# EAGLE design relais_karte (EAGLE 6.6.0)
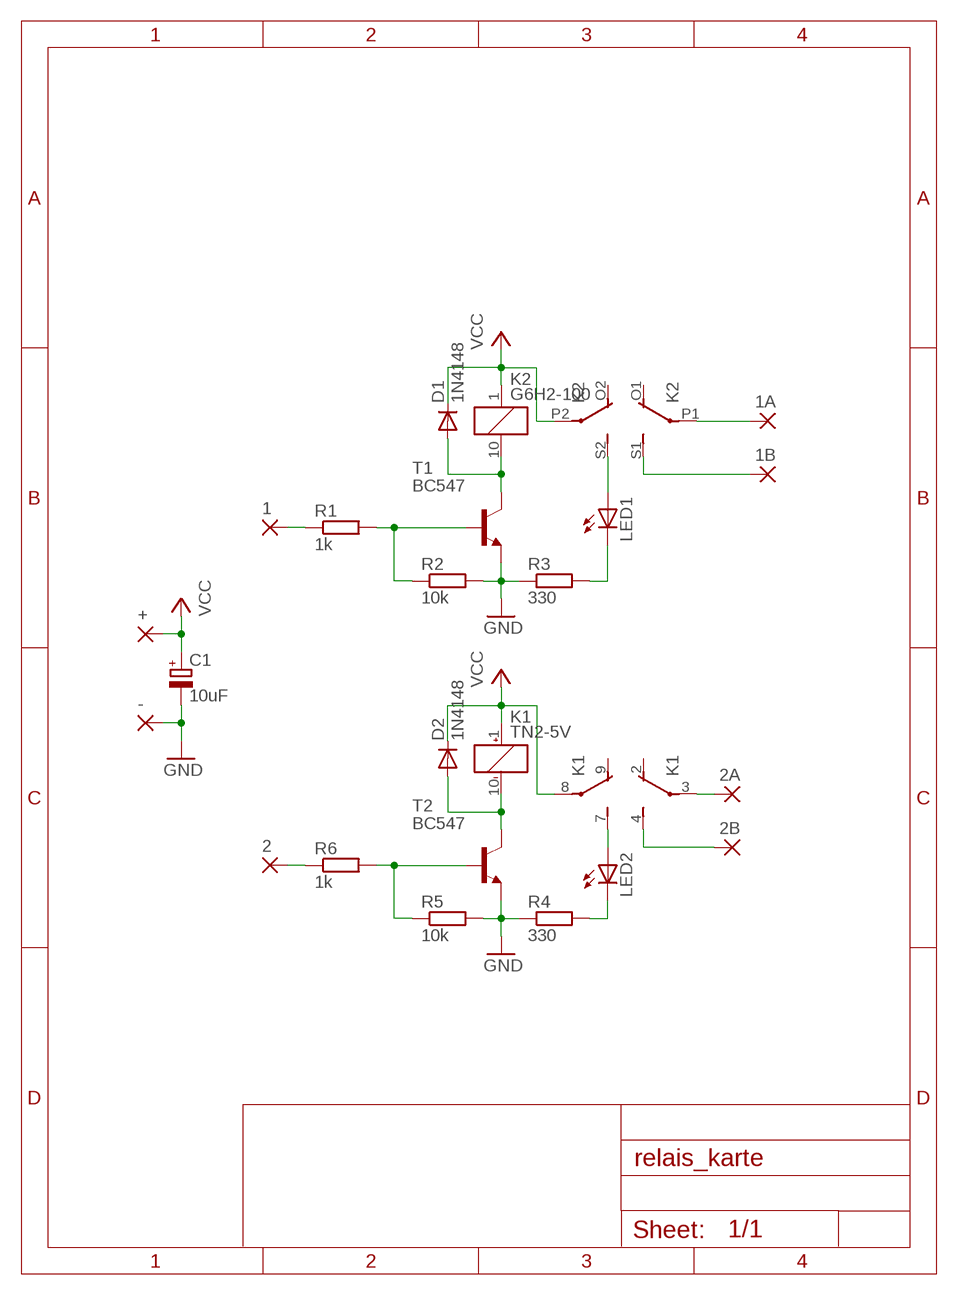
[diagram p0: schematic, sheet 1]

## Parts
1  WIREPAD2,15/1,0  [2,15/1,0]
1A  WIREPAD2,15/1,0  [2,15/1,0]
1B  WIREPAD2,15/1,0  [2,15/1,0]
2  WIREPAD2,15/1,0  [2,15/1,0]
2A  WIREPAD2,15/1,0  [2,15/1,0]
2B  WIREPAD2,15/1,0  [2,15/1,0]
+  WIREPAD2,15/1,0  [2,15/1,0]
-  WIREPAD2,15/1,0  [2,15/1,0]
C1  10uF  CPOL-EUB45181A  [B45181A]
D1  1N4148  1N4148DO35-7  [DO35-7]
D2  1N4148  1N4148DO35-7  [DO35-7]
K1  TN2-5V  [TN2]
K2  G6H2-100  [G6H2-100]
LED1  LED5MM  [LED5MM]
LED2  LED5MM  [LED5MM]
R1  1k  R-EU_0204/7  [0204/7]
R2  10k  R-EU_0204/7  [0204/7]
R3  330  R-EU_0204/7  [0204/7]
R4  330  R-EU_0204/7  [0204/7]
R5  10k  R-EU_0204/7  [0204/7]
R6  1k  R-EU_0204/7  [0204/7]
T1  BC547  -NPN-TO92-EBC  [TO92-EBC]
T2  BC547  -NPN-TO92-EBC  [TO92-EBC]

## Nets
GND: -.1(P) C1.- R2.2 R3.1 R4.1 R5.2 T1.E T2.E
N$1: D1.A K2.10 T1.C
N$2: LED1.K(C) R3.2
N$3: K2.S2(3:S) LED1.A
N$4: 1B.1(P) K2.S1(2:S)
N$5: R1.2 R2.1 T1.B
N$6: 1A.1(P) K2.P1(2:P)
N$7: 1.1(P) R1.1
N$8: D2.A K1.10(-:-) T2.C
N$9: LED2.K(C) R4.2
N$10: K1.7(2:S) LED2.A
N$11: R5.1 R6.2 T2.B
N$12: 2.1(P) R6.1
N$13: 2B.1(P) K1.4(1:S)
N$14: 2A.1(P) K1.3(1:P)
VCC: +.1(P) C1.+ D1.C D2.C K1.1(-:+) K1.8(2:P) K2.1 K2.P2(3:P)
Unconnected: K1.2(1:O) K1.9(2:O) K2.O1(2:O) K2.O2(3:O)

## Library data of the parts
1 1A 1B 2 2A 2B + - = wirepad:WIREPAD: Wire PAD connect wire on PCB
C1 = rcl:CPOL-EU: POLARIZED CAPACITOR, European symbol
D1 D2 = diode:1N4148: DIODE high speed (Philips)
K1 = relay:TN2?-*: SLIM POLARIZED RELAY NAiS Source: http://www.mew-europe.com/.. en_ds_61019_0000.pdf; MF: AROMAT/ MATSUSHITA; MPN: TN2-5V; OC_FARNELL: 1200955; OC_NEWARK: 64K3189
K2 = relay:G6H2-100: RELAY 2 x switch, 0.5 A/125 V AC, 1 A/30 V DC, Omron; OC_FARNELL: unknown; OC_NEWARK: unknown
LED1 LED2 = led:LED: LED OSRAM: - CHIPLED LG R971, LG N971, LY N971, LG Q971, LY Q971, LO R971, LY R971 LH N974, LH R974 LS Q976, LO Q976, LY Q976 LO Q996 - Hyper CHIPLED LW Q18S LB Q993, LB Q99A, LB R99A - SideLED LS A670, LO A670, LY A670, LG A670, LP A670 LB A673, LV A673, LT A673, LW A673 LH A674 LY A675 LS A676, LA A676, LO A676, LY A676, LW A676 LS A679, LY A679, LG A679 - Hyper Micro SIDELED® LS Y876, LA Y876, LO Y876, LY Y876 LT Y87S - SmartLED LW L88C, LW L88S LB L89C, LB L89S, LG L890 LS L89K, LO L89K, LY L89K LS L896, LA L896, LO L896, LY L896 - TOPLED LS T670, LO T670, LY T670, LG T670, LP T670 LSG T670, LSP T670, LSY T670, LOP T670, LYG T670 LG T671, LOG T671, LSG T671 LB T673, LV T673, LT T673, LW T673 LH T674 LS T676, LA T676, LO T676, LY T676, LB T676, LH T676, LSB T676, LW T676 LB T67C, LV T67C, LT T67C, LS T67K, LO T67K, LY T67K, LW E67C LS E67B, LA E67B, LO E67B, LY E67B, LB E67C, LV E67C, LT E67C LW T67C LS T679, LY T679, LG T679 LS T770, LO T770, LY T770, LG T770, LP T770 LB T773, LV T773, LT T773, LW T773 LH T774 LS E675, LA E675, LY E675, LS T675 LS T776, LA T776, LO T776, LY T776, LB T776 LHGB T686 LT T68C, LB T68C - Hyper Mini TOPLED® LB M676 - Mini TOPLED Santana® LG M470 LS M47K, LO M47K, LY M47K Source: http://www.osram.convergy.de LUXEON: - LUMILED® LXK2-PW12-R00, LXK2-PW12-S00, LXK2-PW14-U00, LXK2-PW14-V00 LXK2-PM12-R00, LXK2-PM12-S00, LXK2-PM14-U00 LXK2-PE12-Q00, LXK2-PE12-R00, LXK2-PE12-S00, LXK2-PE14-T00, LXK2-PE14-U00 LXK2-PB12-K00, LXK2-PB12-L00, LXK2-PB12-M00, LXK2-PB14-N00, LXK2-PB14-P00, LXK2-PB14-Q00 LXK2-PR12-L00, LXK2-PR12-M00, LXK2-PR14-Q00, LXK2-PR14-R00 LXK2-PD12-Q00, LXK2-PD12-R00, LXK2-PD12-S00 LXK2-PH12-R00, LXK2-PH12-S00 LXK2-PL12-P00, LXK2-PL12-Q00, LXK2-PL12-R00 Source: www.luxeon.com KINGBRIGHT: KA-3528ASYC Source: www.kingbright.com
R1-R6 = rcl:R-EU_: RESISTOR, European symbol
T1 T2 = transistor:*-NPN-: NPN Transistror BF959 corrected 2008.03.06

## Board
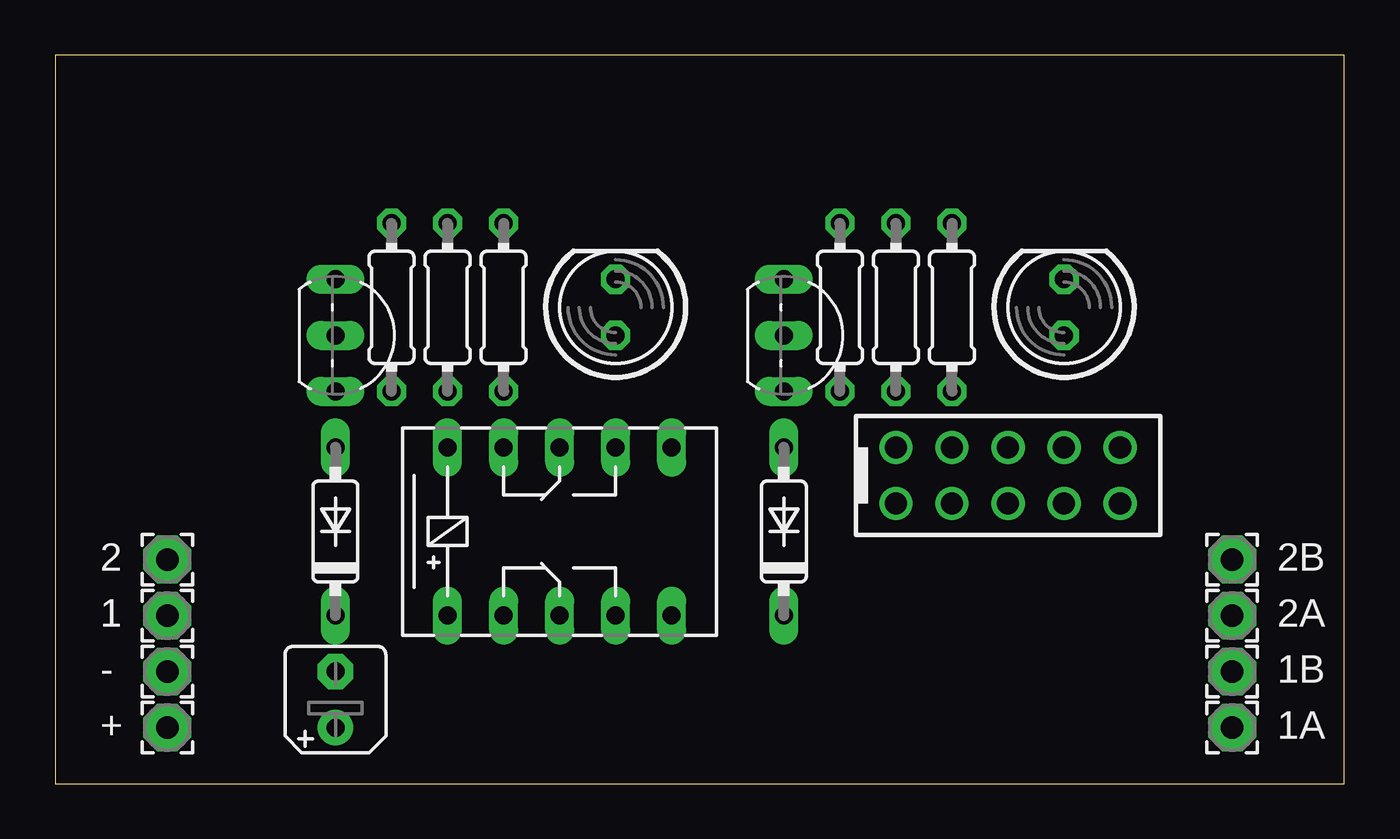
[diagram p1: board, top side]
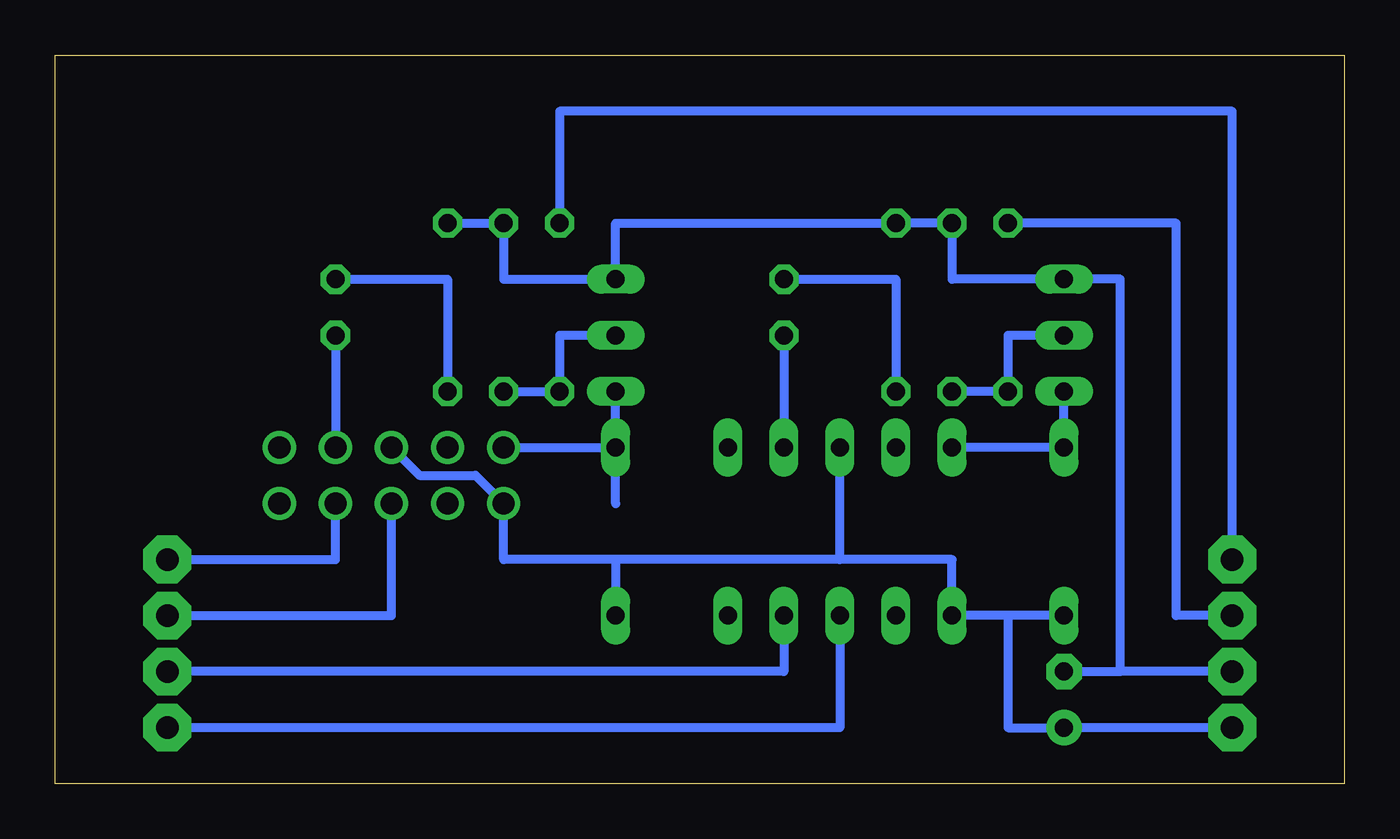
[diagram p2: board, bottom side, seen from below]

Size 58.42 x 33.02 mm. Coordinates in mm from the lower left corner, seen from the top.
Outline: 0,0 58.42,0 58.42,33.02 0,33.02 0,0
Copper layers (1*16): Top 0.035mm / dielectric 1.5mm / Bottom 0.035mm
Design rules "default": minimum track width 10mil, minimum drill 24mil, track to track 8mil, track to pad 8mil, pad to pad 8mil, via to via 8mil, smd to smd 8mil, copper to edge 40mil, drill to drill 8mil, minimum pad ring 10mil, minimum via ring 8mil, stop-mask expansion 4mil, vias tented up to drill 0mil, thermal gap 10mil

### Footprints (pad centres in the part's own frame; a part is rotated, then mirrored left to right if it is on the bottom)
2,15/1,0 = drill 1.016 pad 2.159 octagon: 1 0,0
B45181A = drill 0.813 pad 1.6: + -1.27,0 | drill 0.813 pad 1.6 octagon: - 1.27,0
DO35-7 = drill 0.813 long: A 3.81,0; C -3.81,0
TN2 = drill 1: 1 -5.08,-1.27; 2 -2.54,-1.27; 3 0,-1.27; 4 2.54,-1.27; 5 5.08,-1.27; 6 5.08,1.27; 7 2.54,1.27; 8 0,1.27; 9 -2.54,1.27; 10 -5.08,1.27
G6H2-100 = drill 0.813 long: 1 -5.08,-3.81; 5 5.08,-3.81; 6 5.08,3.81; 10 -5.08,3.81; O1 -2.54,-3.81; O2 -2.54,3.81; P1 0,-3.81; P2 0,3.81; S1 2.54,-3.81; S2 2.54,3.81
LED5MM = drill 0.813 octagon: A -1.27,0; K 1.27,0
0204/7 = drill 0.813 octagon: 1 -3.81,0; 2 3.81,0
TO92-EBC = drill 0.813 long: B 0,-1.27; C 2.54,-1.27; E -2.54,-1.27

### Placement (x,y rotation side)
1  5.08,7.62 0 top
1A  53.34,2.54 0 top
1B  53.34,5.08 0 top
2  5.08,10.16 0 top
2A  53.34,7.62 0 top
2B  53.34,10.16 0 top
+  5.08,2.54 270 top
-  5.08,5.08 270 top
C1  12.7,3.81 90 top
D1  12.7,11.43 90 top
D2  33.02,11.43 90 top
K1  43.18,13.97 0 top
K2  22.86,11.43 0 top
LED1  25.4,21.59 90 top
LED2  45.72,21.59 90 top
R1  15.24,21.59 270 top
R2  17.78,21.59 90 top
R3  20.32,21.59 270 top
R4  40.64,21.59 270 top
R5  38.1,21.59 90 top
R6  35.56,21.59 270 top
T1  13.97,20.32 270 top
T2  34.29,20.32 270 top

### Tracks (layer width: path | path; a pad name or v marks a point on that pad's centre or on a via)
GND
  Bottom 0.406: R4.1 R5.2 38.1,22.86 T2.E 33.02,25.4 R3.1 R2.2 17.78,22.86 T1.E 10.16,22.86 10.16,5.08 | -.1 10.16,5.08 | C1.- 10.16,5.08
N$1
  Bottom 0.406: K2.10 D1.A T1.C
N$2
  Bottom 0.406: LED1.K 20.32,22.86 R3.2
N$3
  Bottom 0.406: LED1.A K2.S2
N$4
  Bottom 0.406: K2.S1 25.4,5.08 1B.1
N$5
  Bottom 0.406: T1.B 15.24,20.32 R1.2 R2.1
N$6
  Bottom 0.406: K2.P1 22.86,2.54 1A.1
N$7
  Bottom 0.406: 1.1 7.62,7.62 7.62,25.4 R1.1
N$8
  Bottom 0.406: D2.A T2.C | K1.10 D2.A | 33.02,12.7 D2.A
N$9
  Bottom 0.406: LED2.K 40.64,22.86 R4.2
N$10
  Bottom 0.406: LED2.A K1.7
N$11
  Bottom 0.406: T2.B 35.56,20.32 R6.2 R5.1
N$12
  Bottom 0.406: 2.1 5.08,30.48 35.56,30.48 R6.1
N$13
  Bottom 0.406: 2B.1 45.72,10.16 K1.4
N$14
  Bottom 0.406: 2A.1 43.18,7.62 K1.3
VCC
  Bottom 0.406: 22.86,10.16 17.78,10.16 K2.1 D1.C 15.24,7.62 15.24,2.54 C1.+ +.1 | 22.86,10.16 33.02,10.16 | 33.02,10.16 D2.C | 22.86,10.16 K2.P2 | 33.02,10.16 38.1,10.16 K1.1 39.37,13.97 41.91,13.97 K1.8